# EAGLE design AVR32UC3B_breakout (EAGLE 5.06)
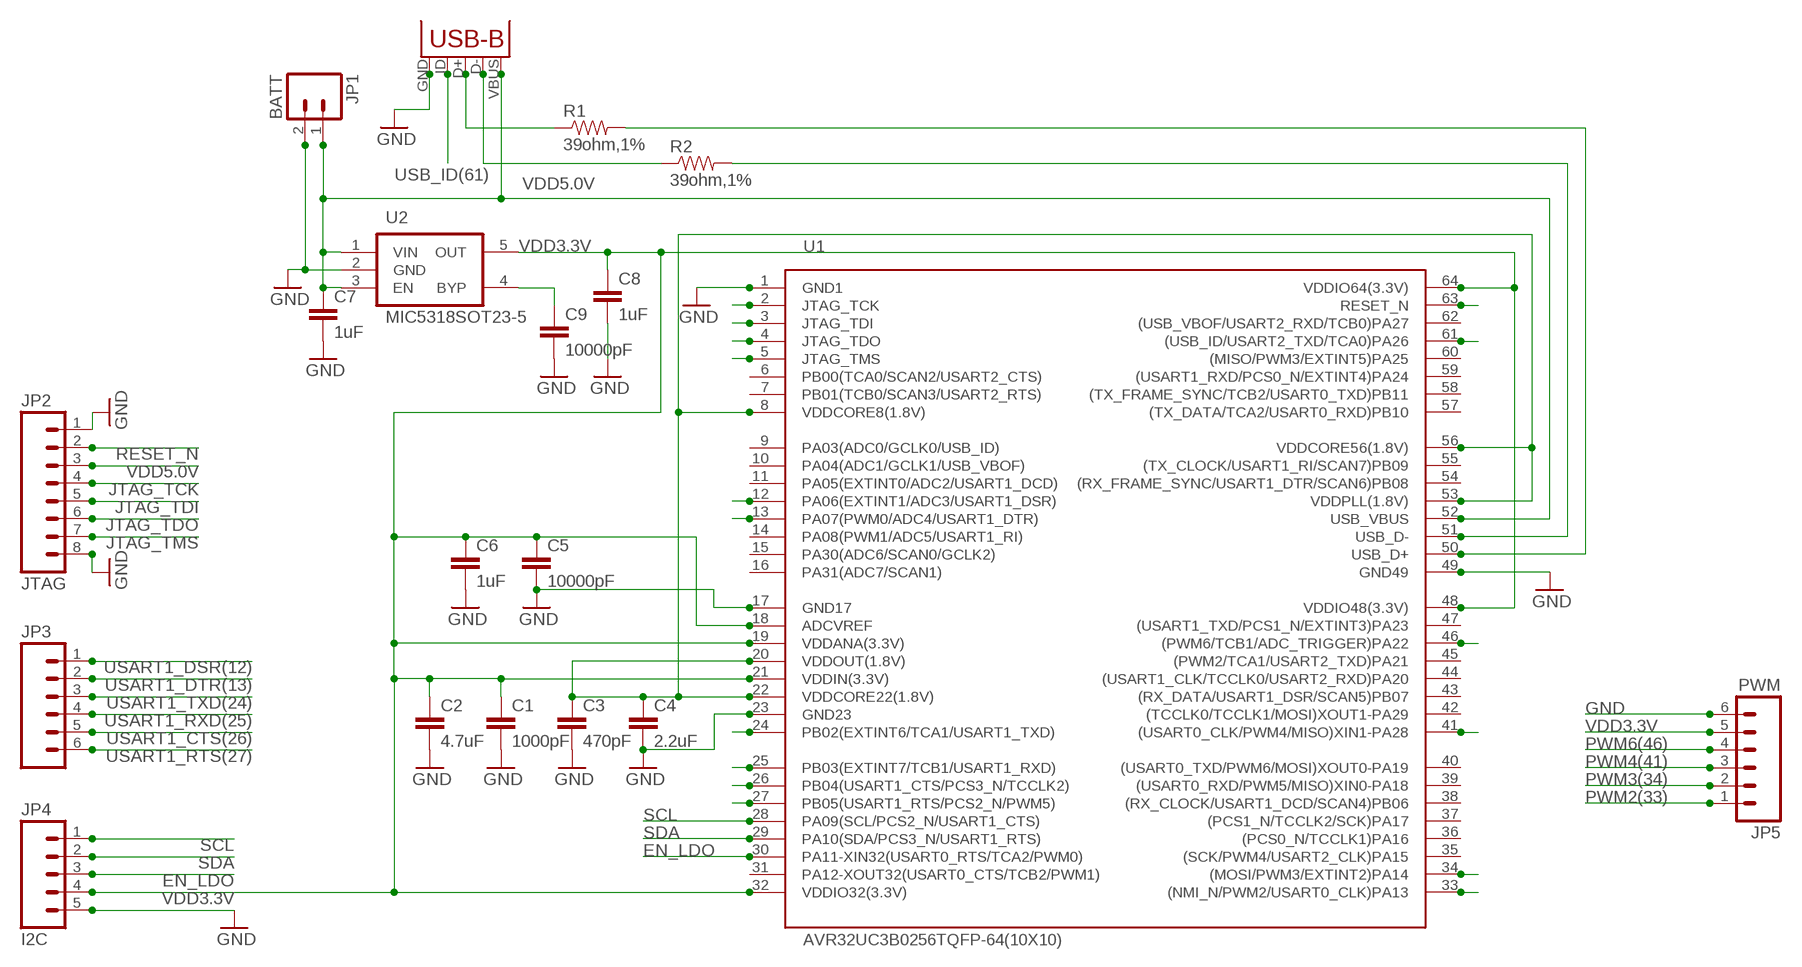
[diagram p0: schematic, sheet 1]

## Parts
C1  1000pF  CAP0603-CAP  [0603-CAP]
C2  4.7uF  CAP1206  [1206]
C3  470pF  CAP0603-CAP  [0603-CAP]
C4  2.2uF  CAP0603-CAP  [0603-CAP]
C5  10000pF  CAP0603-CAP  [0603-CAP]
C6  1uF  CAP0603-CAP  [0603-CAP]
C7  1uF  CAP0603-CAP  [0603-CAP]
C8  1uF  CAP0603-CAP  [0603-CAP]
C9  10000pF  CAP0603-CAP  [0603-CAP]
JP1  BATT  M02-JST-2MM-SMT  [S2B-PH]
JP2  JTAG  M08SMD  [1X08-SMD]
JP3  M06SMD  [1X06-SMD]
JP4  I2C  M05SMD  [1X05-SMD]
JP5  PWM  M06SMD  [1X06-SMD]
R1  39ohm,1%  RESISTOR  [0805]
R2  39ohm,1%  RESISTOR  [0805]
U1  AVR32UC3B0256TQFP-64(10X10)  [TQFP64-10X10]
U2  MIC5318SOT23-5  [SOT23-5]
X1  USB-MINIBSMD  [USB-MINIB]

## Nets
D+: R1.1 X1.D+
D-: R2.1 X1.D-
EN_LDO: JP4.3 U1.30(PA11-XIN32(USART0_RTS/TCA2/PWM0))
GND: C1.2 C2.2 C3.2 C4.2 C5.2 C6.2 C7.2 C8.2 C9.2 JP1.2 JP2.1 JP2.8 JP4.5 JP5.6 U1.1(GND1) U1.17(GND17) U1.23(GND23) U1.49(GND49) U2.2(GND) X1.GND
JTAG_TCK: JP2.4 U1.2(JTAG_TCK)
JTAG_TDI: JP2.5 U1.3(JTAG_TDI)
JTAG_TDO: JP2.6 U1.4(JTAG_TDO)
JTAG_TMS: JP2.7 U1.5(JTAG_TMS)
N$1: C9.1 U2.4(BYP)
PWM2(33): JP5.1 U1.33((NMI_N/PWM2/USART0_CLK)PA13)
PWM3(34): JP5.2 U1.34((MOSI/PWM3/EXTINT2)PA14)
PWM4(41): JP5.3 U1.41((USART0_CLK/PWM4/MISO)XIN1-PA28)
PWM6(46): JP5.4 U1.46((PWM6/TCB1/ADC_TRIGGER)PA22)
RESET_N: JP2.2 U1.63(RESET_N)
SCL: JP4.1 U1.28(PA09(SCL/PCS2_N/USART1_CTS))
SDA: JP4.2 U1.29(PA10(SDA/PCS3_N/USART1_RTS))
USART1_CTS(26): JP3.5 U1.26(PB04(USART1_CTS/PCS3_N/TCCLK2))
USART1_DSR(12): JP3.1 U1.12(PA06(EXTINT1/ADC3/USART1_DSR))
USART1_DTR(13): JP3.2 U1.13(PA07(PWM0/ADC4/USART1_DTR))
USART1_RTS(27): JP3.6 U1.27(PB05(USART1_RTS/PCS2_N/PWM5))
USART1_RXD(25): JP3.4 U1.25(PB03(EXTINT7/TCB1/USART1_RXD))
USART1_TXD(24): JP3.3 U1.24(PB02(EXTINT6/TCA1/USART1_TXD))
USB_D+: R1.2 U1.50(USB_D+)
USB_D-: R2.2 U1.51(USB_D-)
USB_ID(61): U1.61((USB_ID/USART2_TXD/TCA0)PA26) X1.ID
VDD1.8V: C3.1 C4.1 U1.8(VDDCORE8(1.8V)) U1.20(VDDOUT(1.8V)) U1.22(VDDCORE22(1.8V)) U1.53(VDDPLL(1.8V)) U1.56(VDDCORE56(1.8V))
VDD3.3V: C1.1 C2.1 C5.1 C6.1 C8.1 JP4.4 JP5.5 U1.18(ADCVREF) U1.19(VDDANA(3.3V)) U1.21(VDDIN(3.3V)) U1.32(VDDIO32(3.3V)) U1.48(VDDIO48(3.3V)) U1.64(VDDIO64(3.3V)) U2.5(OUT)
VDD5.0V: C7.1 JP1.1 JP2.3 U1.52(USB_VBUS) U2.1(VIN) U2.3(EN) X1.VBUS
Unconnected: U1.6(PB00(TCA0/SCAN2/USART2_CTS)) U1.7(PB01(TCB0/SCAN3/USART2_RTS)) U1.9(PA03(ADC0/GCLK0/USB_ID)) U1.10(PA04(ADC1/GCLK1/USB_VBOF)) U1.11(PA05(EXTINT0/ADC2/USART1_DCD)) U1.14(PA08(PWM1/ADC5/USART1_RI)) U1.15(PA30(ADC6/SCAN0/GCLK2)) U1.16(PA31(ADC7/SCAN1)) U1.31(PA12-XOUT32(USART0_CTS/TCB2/PWM1)) U1.35((SCK/PWM4/USART2_CLK)PA15) U1.36((PCS0_N/TCCLK1)PA16) U1.37((PCS1_N/TCCLK2/SCK)PA17) U1.38((RX_CLOCK/USART1_DCD/SCAN4)PB06) U1.39((USART0_RXD/PWM5/MISO)XIN0-PA18) U1.40((USART0_TXD/PWM6/MOSI)XOUT0-PA19) U1.42((TCCLK0/TCCLK1/MOSI)XOUT1-PA29) U1.43((RX_DATA/USART1_DSR/SCAN5)PB07) U1.44((USART1_CLK/TCCLK0/USART2_RXD)PA20) U1.45((PWM2/TCA1/USART2_TXD)PA21) U1.47((USART1_TXD/PCS1_N/EXTINT3)PA23) U1.54((RX_FRAME_SYNC/USART1_DTR/SCAN6)PB08) U1.55((TX_CLOCK/USART1_RI/SCAN7)PB09) U1.57((TX_DATA/TCA2/USART0_RXD)PB10) U1.58((TX_FRAME_SYNC/TCB2/USART0_TXD)PB11) U1.59((USART1_RXD/PCS0_N/EXTINT4)PA24) U1.60((MISO/PWM3/EXTINT5)PA25) U1.62((USB_VBOF/USART2_RXD/TCB0)PA27)

## Library data of the parts
C1-C9 = haptic-inu:CAP: Capacitor Standard 0603 ceramic capacitor, and 0.1" leaded capacitor.
JP1 = haptic-inu:M02: Header 2 Standard 2-pin 0.1" header. Use with straight break away headers (SKU : PRT-00116), right angle break away headers (PRT-00553), swiss pins (PRT-00743), machine pins (PRT-00117), and female headers (PRT-00115). Molex polarized connector foot print use with SKU : PRT-08233 with associated crimp pins and housings.
JP2 = haptic-inu:M08: Header 8 Standard 8-pin 0.1" header. Use with straight break away headers (SKU : PRT-00116), right angle break away headers (PRT-00553), swiss pins (PRT-00743), machine pins (PRT-00117), and female headers (PRT-00115).
JP3 JP5 = haptic-inu:M06: Header 6 Standard 6-pin 0.1" header. Use with straight break away headers (SKU : PRT-00116), right angle break away headers (PRT-00553), swiss pins (PRT-00743), machine pins (PRT-00117), and female headers (PRT-00115). Molex polarized connector foot print use with SKU : PRT-08094 with associated crimp pins and housings. NOTES ON THE VARIANTS LOCK and LOCK_LONGPADS... This footprint was designed to help hold the alignment of a through-hole component (i.e. 6-pin header) while soldering it into place. You may notice that each hole has been shifted either up or down by 0.005 of an inch from it's more standard position (which is a perfectly straight line). This slight alteration caused the pins (the squares in the middle) to touch the edges of the holes. Because they are alternating, it causes a "brace" to hold the component in place. 0.005 has proven to be the perfect amount of "off-center" position when using our standard breakaway headers. Although looks a little odd when you look at the bare footprint, once you have a header in there, the alteration is very hard to notice. Also, if you push a header all the way into place, it is covered up entirely on the bottom side. This idea of altering the position of holes to aid alignment will be further integrated into the Sparkfun Library for other footprints. It can help hold any component with 3 or more connection pins.
JP4 = haptic-inu:M05: Header 5 Standard 5-pin 0.1" header. Use with straight break away headers (SKU : PRT-00116), right angle break away headers (PRT-00553), swiss pins (PRT-00743), machine pins (PRT-00117), and female headers (PRT-00115). Molex polarized connector foot print use with SKU : PRT-08230 with associated crimp pins and housings.
R1 R2 = haptic-inu:RESISTOR: Resistor Basic schematic elements and footprints for 0603, 1206, and PTH 1/10th watt (small) resistors.
U1 = haptic-inu:AVR32UC3B0256: 32-bit Microcontroller with 256K Bytes In-System Programmable Flash, 32K Bytes Internal High Speed SRAM Source: http://www.atmel.com/dyn/resources/prod_documents/doc32059.pdf
U2 = haptic-inu:MIC5318: Voltage Regulator LDO IC REG ULDO 300MA 3.3V TSOT23-5. 200mV Drop-out voltage at 300mA
X1 = haptic-inu:USB-MINIB: USB Connectors USB-miniB (SMD) is based on the fully proven package SKU : PRT-00587 from SparkFun but enables connection of the USB_ID for host

## Board
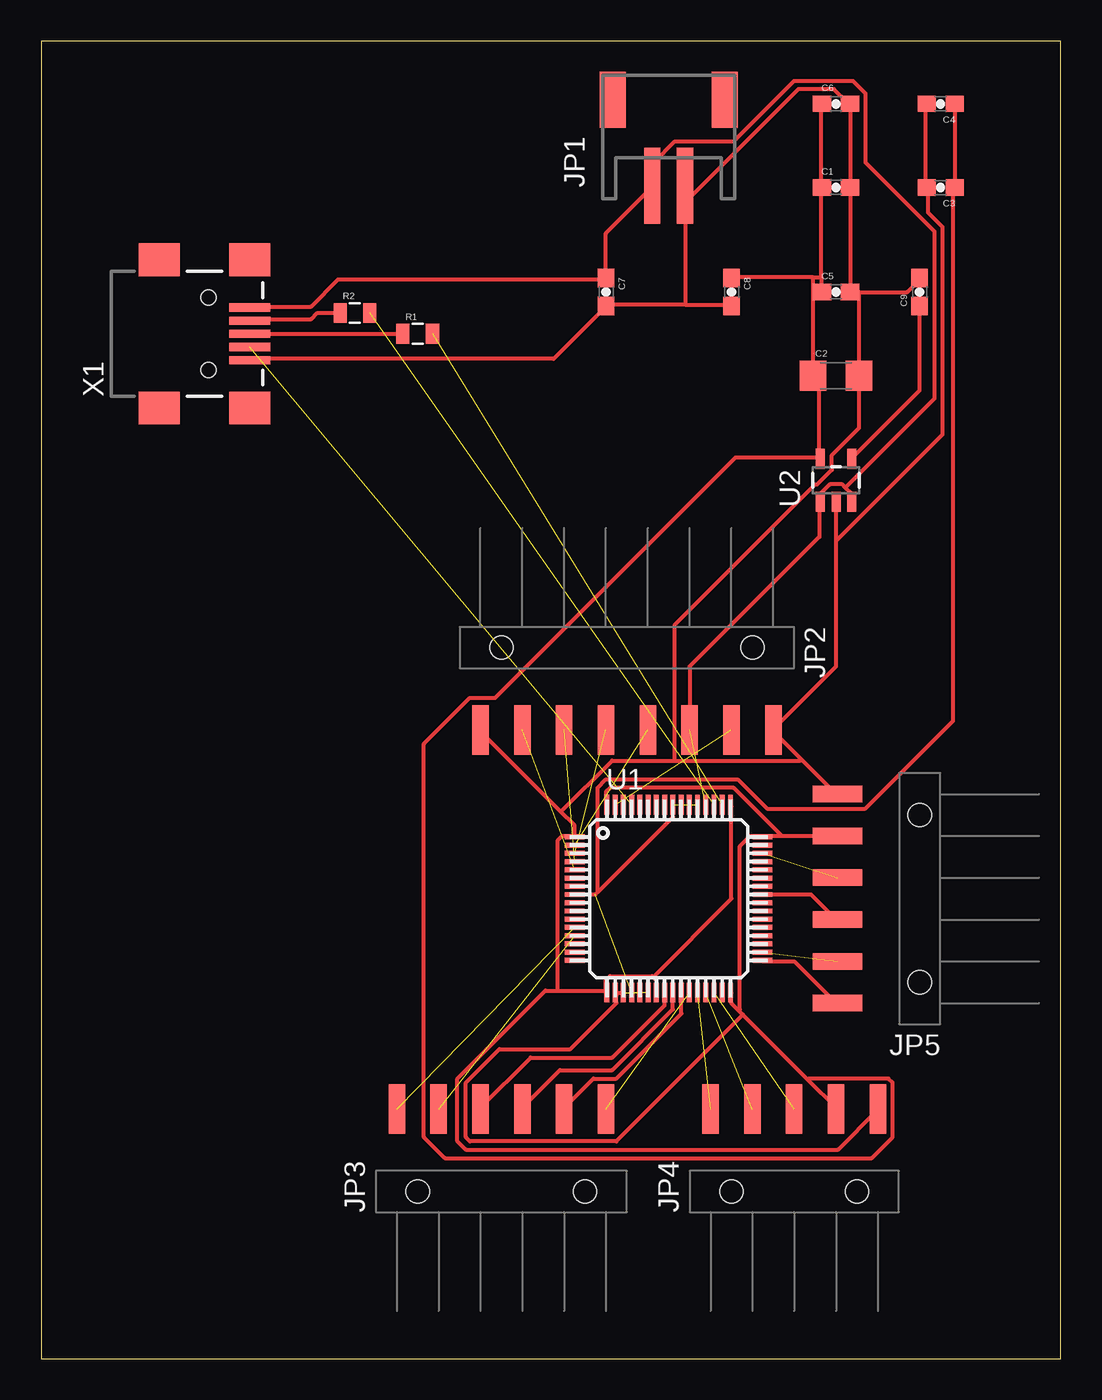
[diagram p1: board, top side]

Size 61.9 x 80 mm. Coordinates in mm from the lower left corner, seen from the top.
Outline: 0,0 61.9,0 61.9,80 0,80 0,0
Copper layers (1*16): Top 0.035mm / dielectric 1.5mm / Bottom 0.035mm
Design rules "default": minimum track width 10mil, minimum drill 24mil, track to track 8mil, track to pad 8mil, pad to pad 8mil, via to via 8mil, smd to smd 8mil, copper to edge 40mil, drill to drill 8mil, minimum pad ring 10mil, minimum via ring 8mil, stop-mask expansion 4mil, vias tented up to drill 0mil, thermal gap 10mil

### Footprints (pad centres in the part's own frame; a part is rotated, then mirrored left to right if it is on the bottom)
0603-CAP = smd 1.1 x 1: 1 -0.85,0; 2 0.85,0
1206 = smd 1.6 x 1.8: 1 -1.4,0; 2 1.4,0
S2B-PH = smd 1 x 4.6: 1 -1,-3.7; 2 1,-3.7 | smd 1.6 x 3.4: NC1 -3.4,1.5; NC2 3.4,1.5
1X08-SMD = smd 1 x 3: 1 -6.35,5; 2 -3.81,5; 3 -1.27,5; 4 1.27,5; 5 3.81,5; 6 6.35,5; 7 8.89,5; 8 11.43,5 | hole 1.4: -5.08,0; 10.16,0
1X06-SMD = smd 1 x 3: 1 -6.35,5; 2 -3.81,5; 3 -1.27,5; 4 1.27,5; 5 3.81,5; 6 6.35,5 | hole 1.4: -5.08,0; 5.08,0
1X05-SMD = smd 1 x 3: 1 -5.08,5; 2 -2.54,5; 3 0,5; 4 2.54,5; 5 5.08,5 | hole 1.4: -3.81,0; 3.81,0
0805 = smd 0.8 x 1.2: 1 -0.9,0; 2 0.9,0
TQFP64-10X10 = smd 1.2 x 0.3: 1 -5.7,3.75; 2 -5.7,3.25; 3 -5.7,2.75; 4 -5.7,2.25; 5 -5.7,1.75; 6 -5.7,1.25; 7 -5.7,0.75; 8 -5.7,0.25; 9 -5.7,-0.25; 10 -5.7,-0.75; 11 -5.7,-1.25; 12 -5.7,-1.75; 13 -5.7,-2.25; 14 -5.7,-2.75; 15 -5.7,-3.25; 16 -5.7,-3.75; 33 5.7,-3.75; 34 5.7,-3.25; 35 5.7,-2.75; 36 5.7,-2.25; 37 5.7,-1.75; 38 5.7,-1.25; 39 5.7,-0.75; 40 5.7,-0.25; 41 5.7,0.25; 42 5.7,0.75; 43 5.7,1.25; 44 5.7,1.75; 45 5.7,2.25; 46 5.7,2.75; 47 5.7,3.25; 48 5.7,3.75 | smd 0.3 x 1.2: 17 -3.75,-5.7; 18 -3.25,-5.7; 19 -2.75,-5.7; 20 -2.25,-5.7; 21 -1.75,-5.7; 22 -1.25,-5.7; 23 -0.75,-5.7; 24 -0.25,-5.7; 25 0.25,-5.7; 26 0.75,-5.7; 27 1.25,-5.7; 28 1.75,-5.7; 29 2.25,-5.7; 30 2.75,-5.7; 31 3.25,-5.7; 32 3.75,-5.7; 49 3.75,5.7; 50 3.25,5.7; 51 2.75,5.7; 52 2.25,5.7; 53 1.75,5.7; 54 1.25,5.7; 55 0.75,5.7; 56 0.25,5.7; 57 -0.25,5.7; 58 -0.75,5.7; 59 -1.25,5.7; 60 -1.75,5.7; 61 -2.25,5.7; 62 -2.75,5.7; 63 -3.25,5.7; 64 -3.75,5.7
SOT23-5 = smd 0.55 x 1.2: 1 -0.95,-1.3; 2 0,-1.3; 3 0.95,-1.3; 4 0.95,1.3; 5 -0.95,1.3
USB-MINIB = smd 2.5 x 0.5: D+ 2.5,0; D- 2.5,0.8; GND 2.5,-1.6; ID 2.5,-0.8; VBUS 2.5,1.6 | smd 2.5 x 2: GND@1 -3,-4.5; GND@2 -3,4.5; GND@3 2.5,4.5; GND@4 2.5,-4.5 | hole 0.9: 0,2.2; 0,-2.2

### Placement (x,y rotation side)
C1  48.26,71.12 0 top
C2  48.26,59.69 0 top
C3  54.61,71.12 180 top
C4  54.61,76.2 180 top
C5  48.26,64.77 0 top
C6  48.26,76.2 0 top
C7  34.29,64.77 270 top
C8  41.91,64.77 270 top
C9  53.34,64.77 90 top
JP1  38.1,74.93 0 top
JP2  38.1,43.18 180 top
JP3  27.94,10.16 0 top
JP4  45.72,10.16 0 top
JP5  53.34,27.94 90 top
R1  22.86,62.23 0 top
R2  19.05,63.5 0 top
U1  38.1,27.94 0 top
U2  48.26,53.34 0 top
X1  10.16,62.23 0 top

### Tracks (layer width: path | path; a pad name or v marks a point on that pad's centre or on a via)
D+
  Top 0.254: X1.D+ R1.1
D-
  Top 0.254: R2.1 16.76,63.5 16.38,63.12 12.7,63.12 X1.D-
EN_LDO  (1 unrouted)
GND
  Top 0.254: 49.15,71.12 49.15,76.2 C6.2 49.02,76.2 48.13,77.09 45.97,77.09 39.12,70.23 | 49.66,64.77 52.58,64.77 53.34,65.53 C9.2 | C2.2 49.66,64.77 | 49.66,64.77 49.15,64.77 | 49.15,64.77 49.15,71.12 | 49.15,71.12 C1.2 | 49.15,64.77 C5.2 | 39.12,64.01 41.91,64.01 C8.2 | 39.12,64.01 34.29,64.01 C7.2 34.29,63.88 31.11,60.71 12.7,60.71 X1.GND | 39.12,70.23 39.12,64.01 | 39.12,70.23 39.12,71.12 JP1.2 39.12,70.23 | 31.56,33.21 26.67,38.1 JP2.8 | 31.56,33.21 32.38,32.38 32.38,31.75 U1.1 32.26,31.75 31.62,31.75 31.37,31.5 31.37,22.35 | 34.29,22.35 34.29,22.99 34.54,23.24 37.08,23.24 37.15,23.18 | 37.15,23.18 37.34,22.99 37.34,22.35 U1.23 | 34.29,22.35 U1.17 | U1.49 41.91,33.53 41.91,27.94 37.15,23.18 | 31.37,22.35 30.61,22.35 25.27,17.02 25.27,13.21 25.78,12.7 48.39,12.7 50.8,15.11 JP4.5 | 31.37,22.35 34.29,22.35 | C4.2 53.72,76.2 53.72,71.12 C3.2 53.85,71.12 53.85,69.6 54.74,68.71 54.74,56.13 48.26,49.66 | 48.26,49.66 48.26,42.04 44.45,38.23 JP2.1 44.45,38.1 46.16,36.39 | 48.26,49.66 U2.2 | 46.16,36.39 48.26,34.29 JP5.6 | 38.48,36.32 46.1,36.32 46.16,36.39 | 38.48,36.32 34.67,36.32 31.56,33.21 | C2.2 49.66,56.52 48.01,54.86 48.01,53.98 47.12,53.09 46.99,53.09 38.48,44.58 38.48,36.32 | C2.2
JTAG_TCK  (1 unrouted)
JTAG_TDI  (1 unrouted)
JTAG_TDO  (1 unrouted)
JTAG_TMS  (1 unrouted)
N$1
  Top 0.254: C9.1 53.34,58.8 49.28,54.74 U2.4
PWM2(33)
  Top 0.254: U1.33 43.81,24.13 45.72,24.13 48.26,21.59 JP5.1
PWM3(34)  (1 unrouted)
PWM4(41)
  Top 0.254: U1.41 43.81,28.19 46.74,28.19 48.26,26.67 JP5.3
PWM6(46)  (1 unrouted)
RESET_N  (1 unrouted)
SCL  (1 unrouted)
SDA  (1 unrouted)
USART1_CTS(26)
  Top 0.254: U1.26 38.86,22.23 38.86,20.95 34.92,17.02 33.53,17.02 31.75,15.24 JP3.5
USART1_DSR(12)  (1 unrouted)
USART1_DTR(13)  (1 unrouted)
USART1_RTS(27)  (1 unrouted)
USART1_RXD(25)
  Top 0.254: U1.25 38.35,22.23 38.35,21.21 34.67,17.53 31.5,17.53 29.21,15.24 JP3.4
USART1_TXD(24)
  Top 0.254: U1.24 37.85,22.23 37.85,21.46 34.67,18.29 29.72,18.29 26.67,15.24 JP3.3
USB_D+  (1 unrouted)
USB_D-  (1 unrouted)
USB_ID(61)  (1 unrouted)
VDD1.8V  (3 unrouted)
  Top 0.254: C4.1 55.5,76.2 55.5,71.12 C3.1 55.37,71.12 55.37,38.73 50.04,33.4 44.07,33.4 42.29,35.18 34.29,35.18 33.78,34.67 33.78,28.45 33.85,28.38 | 33.85,28.38 38.35,32.89 38.35,33.53 U1.56 | 33.85,28.38 33.66,28.19 32.51,28.19 U1.8
VDD3.3V  (1 unrouted)
  Top 0.254: C2.1 47.24,59.31 47.24,54.74 U2.5 47.12,54.74 42.16,54.74 27.56,40.13 26.04,40.13 23.24,37.34 23.24,13.46 24.51,12.19 50.42,12.19 51.69,13.46 51.69,16.76 51.44,17.02 46.61,17.02 46.55,16.95 | 47.37,65.66 47.37,71.12 | 47.37,65.66 47.37,64.77 C5.1 | 46.86,65.66 47.37,65.66 | 46.86,65.66 41.91,65.66 C8.1 | 47.37,71.12 47.37,76.2 C6.1 | 47.37,71.12 C1.1 | C2.1 46.86,65.66 | C2.1 | 44.96,31.75 43.81,31.75 U1.48 43.69,31.75 43.05,31.75 42.42,31.11 42.42,21.21 42.35,21.14 | 44.96,31.75 JP5.5 | 44.96,31.75 42.04,34.67 34.54,34.67 34.29,34.42 34.29,33.66 U1.64 | U1.19 35.31,22.23 34.92,22.23 U1.18 34.92,22.1 34.92,21.59 32.13,18.8 27.81,18.8 25.78,16.76 25.78,13.46 26.04,13.21 34.92,13.21 42.61,20.89 | 46.55,16.95 48.26,15.24 JP4.4 | 46.55,16.95 42.61,20.89 | 42.61,20.89 42.35,21.14 | 42.35,21.14 41.91,21.59 41.91,22.23 U1.32
VDD5.0V  (1 unrouted)
  Top 0.254: 48.83,52.9 49.15,52.58 49.15,52.07 U2.3 | 48.83,52.9 48.64,53.09 47.88,53.09 47.37,52.58 47.37,52.07 U2.1 47.24,51.94 47.24,49.91 39.37,42.04 JP2.3 | X1.VBUS 12.7,63.88 16.38,63.88 18.03,65.53 34.29,65.53 C7.1 34.29,68.33 37.08,71.12 JP1.1 37.21,71.25 37.21,72.64 38.48,73.91 42.04,73.91 45.72,77.6 49.28,77.6 50.04,76.83 50.04,72.64 54.23,68.45 54.23,58.29 48.83,52.9